# EAGLE design led-er-v2 (EAGLE 7.2.0)
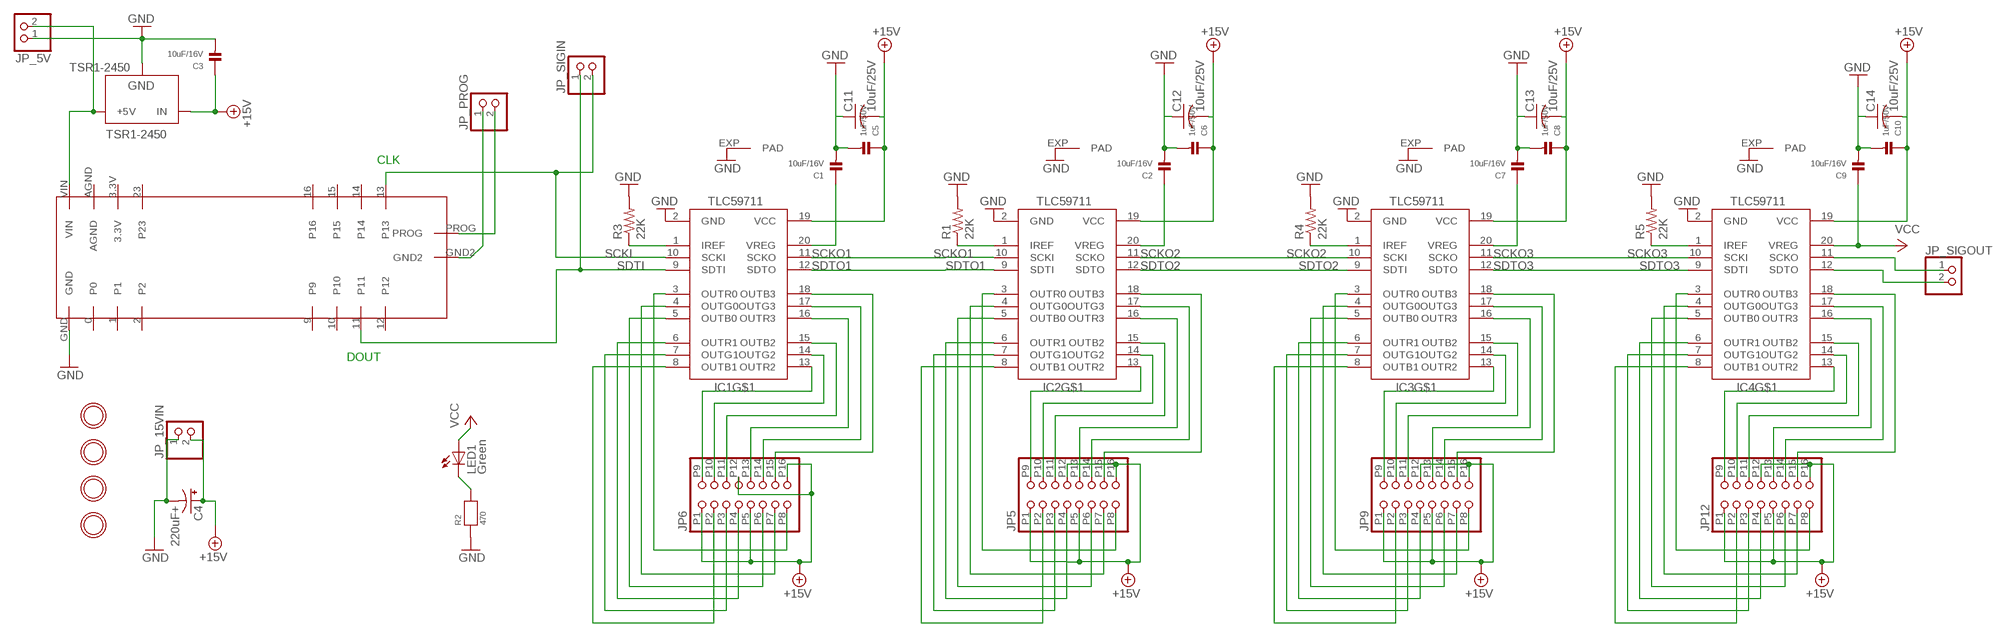
[diagram p0: schematic, sheet 1]

## Parts
C1  10uF/16V  CAP_CERAMIC0805  [0805]
C2  10uF/16V  CAP_CERAMIC0805  [0805]
C3  10uF/16V  CAP_CERAMIC0805  [0805]
C4  220uF+  CPOL-USE5-8.5  [E5-8,5]
C5  1uF/50V  CAP_CERAMIC0805  [0805]
C6  1uF/50V  CAP_CERAMIC0805  [0805]
C7  10uF/16V  CAP_CERAMIC0805  [0805]
C8  1uF/50V  CAP_CERAMIC0805  [0805]
C9  10uF/16V  CAP_CERAMIC0805  [0805]
C10  1uF/50V  CAP_CERAMIC0805  [0805]
C11  10uF/25V  C-USC0805  [C0805]
C12  10uF/25V  C-USC0805  [C0805]
C13  10uF/25V  C-USC0805  [C0805]
C14  10uF/25V  C-USC0805  [C0805]
IC1  TLC59711  [HTSSOP20DAP]
IC2  TLC59711  [HTSSOP20DAP]
IC3  TLC59711  [HTSSOP20DAP]
IC4  TLC59711  [HTSSOP20DAP]
JP5  HEADER-2X8  [2X08]
JP6  HEADER-2X8  [2X08]
JP9  HEADER-2X8  [2X08]
JP12  HEADER-2X8  [2X08]
JP_5V  HEADER-1X2  [1X02_OVAL]
JP_15VIN  HEADER-1X2  [1X02_OVAL]
JP_PROG  HEADER-1X2  [1X02_OVAL]
JP_SIGIN  HEADER-1X2  [1X02_OVAL]
JP_SIGOUT  HEADER-1X2  [1X02_OVAL]
LED1  Green  LEDCHIP-LED0805  [CHIP-LED0805]
R1  22K  R-US_FLIPFLOP7  [0805-THM-7]
R2  470  RESISTOR0805  [0805]
R3  22K  R-US_FLIPFLOP7  [0805-THM-7]
R4  22K  R-US_FLIPFLOP7  [0805-THM-7]
R5  22K  R-US_FLIPFLOP7  [0805-THM-7]
TSR1-2450  TSR1-2450  [TSR-1]
U$1  MOUNTINGHOLE  [MOUNTINGHOLE_3.0_PLATED]
U$2  MOUNTINGHOLE  [MOUNTINGHOLE_3.0_PLATED]
U$3  MOUNTINGHOLE  [MOUNTINGHOLE_3.0_PLATED]
U$4  MOUNTINGHOLE  [MOUNTINGHOLE_3.0_PLATED]
U$5  TEENSY_LEDER  [TEENSY_LEDER]

## Nets
+15V: C3.1 C4.+ C5.1 C6.1 C8.1 C10.1 C11.2 C12.2 C13.2 C14.2 IC1.19(VCC) IC2.19(VCC) IC3.19(VCC) IC4.19(VCC) JP5.P1 JP5.P5 JP5.P12 JP5.P16 JP6.P1 JP6.P5 JP6.P12 JP6.P16 JP9.P1 JP9.P5 JP9.P12 JP9.P16 JP12.P1 JP12.P5 JP12.P12 JP12.P16 JP_15VIN.2 TSR1-2450.1(IN)
GND: C1.2 C2.2 C3.2 C4.- C5.2 C6.2 C7.2 C8.2 C9.2 C10.2 C11.1 C12.1 C13.1 C14.1 IC1.2(GND) IC1.EXP(PAD) IC2.2(GND) IC2.EXP(PAD) IC3.2(GND) IC3.EXP(PAD) IC4.2(GND) IC4.EXP(PAD) JP_5V.1 JP_15VIN.1 R1.2 R2.1 R3.2 R4.2 R5.2 TSR1-2450.2(GND) U$5.GND
JP1: JP_5V.2 TSR1-2450.3(+5V) U$5.VIN
N$1: LED1.C R2.2
N$2: IC1.1(IREF) R3.1
N$3: IC1.3(OUTR0) JP6.P8
N$4: IC1.4(OUTG0) JP6.P7
N$5: IC1.5(OUTB0) JP6.P6
N$6: IC1.6(OUTR1) JP6.P4
N$7: IC1.7(OUTG1) JP6.P3
N$8: IC1.8(OUTB1) JP6.P2
N$9: IC1.13(OUTR2) JP6.P9
N$10: IC1.14(OUTG2) JP6.P10
N$11: IC1.15(OUTB2) JP6.P11
N$12: IC1.16(OUTR3) JP6.P13
N$13: IC1.17(OUTG3) JP6.P14
N$14: IC1.18(OUTB3) JP6.P15
N$15: IC2.1(IREF) R1.1
N$16: IC2.3(OUTR0) JP5.P8
N$17: IC2.4(OUTG0) JP5.P7
N$18: IC2.5(OUTB0) JP5.P6
N$19: IC2.6(OUTR1) JP5.P4
N$20: IC2.7(OUTG1) JP5.P3
N$21: IC2.8(OUTB1) JP5.P2
N$22: IC2.13(OUTR2) JP5.P9
N$23: IC2.14(OUTG2) JP5.P10
N$24: IC2.15(OUTB2) JP5.P11
N$25: IC2.16(OUTR3) JP5.P13
N$26: IC2.17(OUTG3) JP5.P14
N$27: IC2.18(OUTB3) JP5.P15
N$28: IC3.1(IREF) R4.1
N$29: IC3.3(OUTR0) JP9.P8
N$30: IC3.4(OUTG0) JP9.P7
N$31: IC3.5(OUTB0) JP9.P6
N$32: IC3.6(OUTR1) JP9.P4
N$33: IC3.7(OUTG1) JP9.P3
N$34: IC3.8(OUTB1) JP9.P2
N$35: IC3.13(OUTR2) JP9.P9
N$36: IC3.14(OUTG2) JP9.P10
N$37: IC3.15(OUTB2) JP9.P11
N$38: IC3.16(OUTR3) JP9.P13
N$39: IC3.17(OUTG3) JP9.P14
N$40: IC3.18(OUTB3) JP9.P15
N$41: IC4.1(IREF) R5.1
N$42: IC4.3(OUTR0) JP12.P8
N$43: IC4.4(OUTG0) JP12.P7
N$44: IC4.5(OUTB0) JP12.P6
N$45: IC4.6(OUTR1) JP12.P4
N$46: IC4.7(OUTG1) JP12.P3
N$47: IC4.8(OUTB1) JP12.P2
N$48: IC4.13(OUTR2) JP12.P9
N$49: IC4.14(OUTG2) JP12.P10
N$50: IC4.15(OUTB2) JP12.P11
N$51: IC4.16(OUTR3) JP12.P13
N$52: IC4.17(OUTG3) JP12.P14
N$53: IC4.18(OUTB3) JP12.P15
N$54: JP_PROG.1 U$5.GND2
N$55: JP_PROG.2 U$5.PROG
N$56: C1.1 IC1.20(VREG)
N$57: C7.1 IC3.20(VREG)
N$58: C2.1 IC2.20(VREG)
N$59: IC4.11(SCKO) JP_SIGOUT.1
N$60: IC4.12(SDTO) JP_SIGOUT.2
SCKI: IC1.10(SCKI) JP_SIGIN.2 U$5.13
SCKO1: IC1.11(SCKO) IC2.10(SCKI)
SCKO2: IC2.11(SCKO) IC3.10(SCKI)
SCKO3: IC3.11(SCKO) IC4.10(SCKI)
SDTI: IC1.9(SDTI) JP_SIGIN.1 U$5.11
SDTO1: IC1.12(SDTO) IC2.9(SDTI)
SDTO2: IC2.12(SDTO) IC3.9(SDTI)
SDTO3: IC3.12(SDTO) IC4.9(SDTI)
VCC: C9.1 IC4.20(VREG) LED1.A
Unconnected: U$5.0 U$5.1 U$5.2 U$5.3.3V U$5.9 U$5.10 U$5.12 U$5.14 U$5.15 U$5.16 U$5.23 U$5.AGND

## Notes on the sheet
- CLK
- DOUT

## Library data of the parts
C1-C3 C5-C10 = microbuilder:CAP_CERAMIC: Ceramic Capacitors 0402 - 0402 Surface Mount Capacitors 16pF 50V 5% [Digikey: 445-4899-2-ND] 18pF 50V 5% [Digikey: 490-1281-2-ND] 22pF 50V 5% [Digikey: 490-1283-2-ND] 68pF 50V 5% [Digikey: 490-1289-2-ND] 0.1uF 10V 10% [Digikey: 490-1318-2-ND] 1.0uF 6.3V 10% [Digikey: 490-1320-2-ND] 0603 - 0603 Surface Mount Capacitors 16 pF 50V 5% [Digikey: 445-5051-2-ND] 22 pF 50V [Digikey: PCC220ACVTR-ND] 33 pF 50V 5% [Digikey: 490-1415-1-ND] 56pF 50V 5% [Digikey: 490-1421-1-ND] 220pF 50V 5% [Digikey: 445-1285-1-ND] 680 pF 50V 2200 pF 50V 5% C0G [Digikey: 445-1297-1-ND] 5600 pF 100V 5% X7R [Digikey: 478-3711-1-ND] 0.1 µF 25V 10% [Digikey: PCC2277TR-ND] 0.22 µF 16V 10% X7R [Digikey: 445-1318-1-ND] 1.0 µF 25V 10% [Digikey: 445-5146-2-ND] 0603 - RF Specific 3pF 250V +/-0.1pF RF [Digikey: 712-1347-1-ND] 18 pF 250V 5% [Digikey: 478-3505-1-ND or 712-1322-1-ND] 56 pF 250V 5% C0G RF [Digikey: 490-4867-1-ND] 68 pF 250V RF [Digikey: 490-4868-1-ND] 0805 - 0805 Surface Mount Capacitors 220 pF 250V 2% RF Ceramic Capacitor [Digikey: 712-1398-1-ND] 1000 pF 50V 2% NP0 Ceramic Capacitor [Digikey: 478-3760-1-ND] 0.1 µF 25V 10% Ceramic Capacitor [Digikey: PCC1828TR-ND] 1.0 µF 16V 10% Ceramic Capacitor[Digikey: 490-1691-2-ND] 10.0 µF 10V 10% Ceramic Capacitor[Digikey: 709-1228-1-ND] 10.0 uF 16V 10% Ceramic Capacitor [Digikey: 478-5165-2-ND] 47 uF 6.3V 20% Ceramic Capacitor [Digikey: 587-1779-1-ND or 399-5506-1-ND] 1206 - 1206 Surface Mount Capacitors 47uF 10V 20% Ceramic Capacitor [Digikey: 490-5528-1-ND or 399-5508-1-ND or 445-6010-1-ND] 100uF 6.3V -20%, +80% Y5V Ceramic Capacitor (Digikey: 490-4512-1-ND, Mouser: 81-GRM31CF50J107ZE1L)
C4 = adafruit:CPOL-US: POLARIZED CAPACITOR, American symbol
C11-C14 = adafruit:C-US: CAPACITOR, American symbol
IC1-IC4 = adafruit:TLC59711
JP5 JP6 JP9 JP12 = Andrews:HEADER-2X8: 2x8 shrouded header
JP_5V JP_15VIN JP_PROG JP_SIGIN JP_SIGOUT = microbuilder:HEADER-1X2: PIN HEADER
LED1 = adafruit:LED: LED OSRAM: - CHIPLED LG R971, LG N971, LY N971, LG Q971, LY Q971, LO R971, LY R971 LH N974, LH R974 LS Q976, LO Q976, LY Q976 LO Q996 - Hyper CHIPLED LW Q18S LB Q993, LB Q99A, LB R99A - SideLED LS A670, LO A670, LY A670, LG A670, LP A670 LB A673, LV A673, LT A673, LW A673 LH A674 LY A675 LS A676, LA A676, LO A676, LY A676, LW A676 LS A679, LY A679, LG A679 - Hyper Micro SIDELED® LS Y876, LA Y876, LO Y876, LY Y876 LT Y87S - SmartLED LW L88C, LW L88S LB L89C, LB L89S, LG L890 LS L89K, LO L89K, LY L89K LS L896, LA L896, LO L896, LY L896 - TOPLED LS T670, LO T670, LY T670, LG T670, LP T670 LSG T670, LSP T670, LSY T670, LOP T670, LYG T670 LG T671, LOG T671, LSG T671 LB T673, LV T673, LT T673, LW T673 LH T674 LS T676, LA T676, LO T676, LY T676, LB T676, LH T676, LSB T676, LW T676 LB T67C, LV T67C, LT T67C, LS T67K, LO T67K, LY T67K, LW E67C LS E67B, LA E67B, LO E67B, LY E67B, LB E67C, LV E67C, LT E67C LW T67C LS T679, LY T679, LG T679 LS T770, LO T770, LY T770, LG T770, LP T770 LB T773, LV T773, LT T773, LW T773 LH T774 LS E675, LA E675, LY E675, LS T675 LS T776, LA T776, LO T776, LY T776, LB T776 LHGB T686 LT T68C, LB T68C - Hyper Mini TOPLED® LB M676 - Mini TOPLED Santana® LG M470 LS M47K, LO M47K, LY M47K Source: http://www.osram.convergy.de/
R1 R3-R5 = adafruit:R-US_: RESISTOR, American symbol
R2 = microbuilder:RESISTOR: Resistors 0402 - 0402 Surface Mount Package 22 Ohm 1% 1/16W [Digikey: 311-22.0LRTR-ND] 33 Ohm 5% 1/16W 1.0K 5% 1/16W 1.5K 5% 1/16W 2.0K 1% 1/16W 10.0K 1% 1/16W [Digikey: 311-10.0KLRTR-ND] 10.0K 5% 1/16W [Digikey: RMCF0402JT10K0TR-ND] 12.1K 1% 1/16W [Digikey: 311-22.0LRTR-ND] 100.0K 5% 1/16W 0603 - 0603 Surface Mount Package 0 Ohm 1/10 Watt 1% Resistor 15 Ohm 1/10 Watt 1% Resistor 33 Ohm 1/10 Watt 1% Resistor 49.9 Ohm 1/10 Watt 1% Resistor 100 Ohm 1/10 Watt 1% Resistor 150 Ohm 1/10 Watt 1% Resistor 240 Ohm 1/10 Watt 1% Resistor 390 Ohm 1/10 Watt 1% Resistor 560 Ohm 1/10 Watt 1% Resistor 680 Ohm 1/10 Watt 1% Resistor 750 Ohm 1/10 Watt 1% Resistor 1.0K Ohm 1/10 Watt 1% Resistor 1.5K Ohm 1/10 Watt 1% Resistor 2.0K Ohm 1/10 Watt 1% Resistor 2.2K Ohm 1/10 Watt 1% Resistor 3.3K Ohm 1/10 Watt 1% Resistor 4.7K Ohm 1/10 Watt 1% Resistor 10.0K Ohm 1/10 Watt 1% Resistor 12.0K Ohm 1/10 Watt 1% Resistor 12.1K Ohm 1/10 Watt 1% Resistor 20.0K Ohm 1/10 Watt 1% Resistor 33.0K Ohm 1/10 Watt 1% Resistor 100.0K Ohm 1/10 Watt 1% Resistor 0805 - 0805 Surface Mount Package 0 Ohm 1/8 Watt 1% Resistor 33 Ohm 1/8 Watt 1% Resistor 100 Ohm 1/8 Watt 1% Resistor 150 Ohm 1/8 Watt 1% Resistor 200 Ohm 1/8 Watt 1% Resistor 240 Ohm 1/8 Watt 1% Resistor 330 Ohm 1/8 Watt 1% Resistor 390 Ohm 1/8 Watt 1% Resistor 470 Ohm 1/8 Watt 1% Resistor 1.0K Ohm 1/8 Watt 1% Resistor 1.5K Ohm 1/8 Watt 1% Resistor 2.0K Ohm 1/8 Watt 1% Resistor 4.7K Ohm 1/8 Watt 1% Resistor 5.1K Ohm 1/8 Watt 1% Resistor 5.6K Ohm 1/8 Watt 1% Resistor 10.0K Ohm 1/8 Watt 1% Resistor 22.0K Ohm 1/8 Watt 1% Resistor 33.0K Ohm 1/8 Watt 1% Resistor 100K Ohm 1/8 Watt 1% Resistor 1206 - 1206 Surface Mount Package 2012 - 2010 Surface Mount Package 0.11 Ohm 1/2 Watt 1% Resistor - Digikey: RHM.11UCT-ND
TSR1-2450 = SteelCaveRobotics-Power:TSR1-2450: Traco Power TSR 1-2450 5.0v switching regulator
U$1-U$4 = microbuilder:MOUNTINGHOLE: Mounting Hole For #2 screws (0.086"/2.18mm width, 0.094"/2.4mm hole) use 2.5mm
U$5 = Andrews:TEENSY_LEDER

## Board
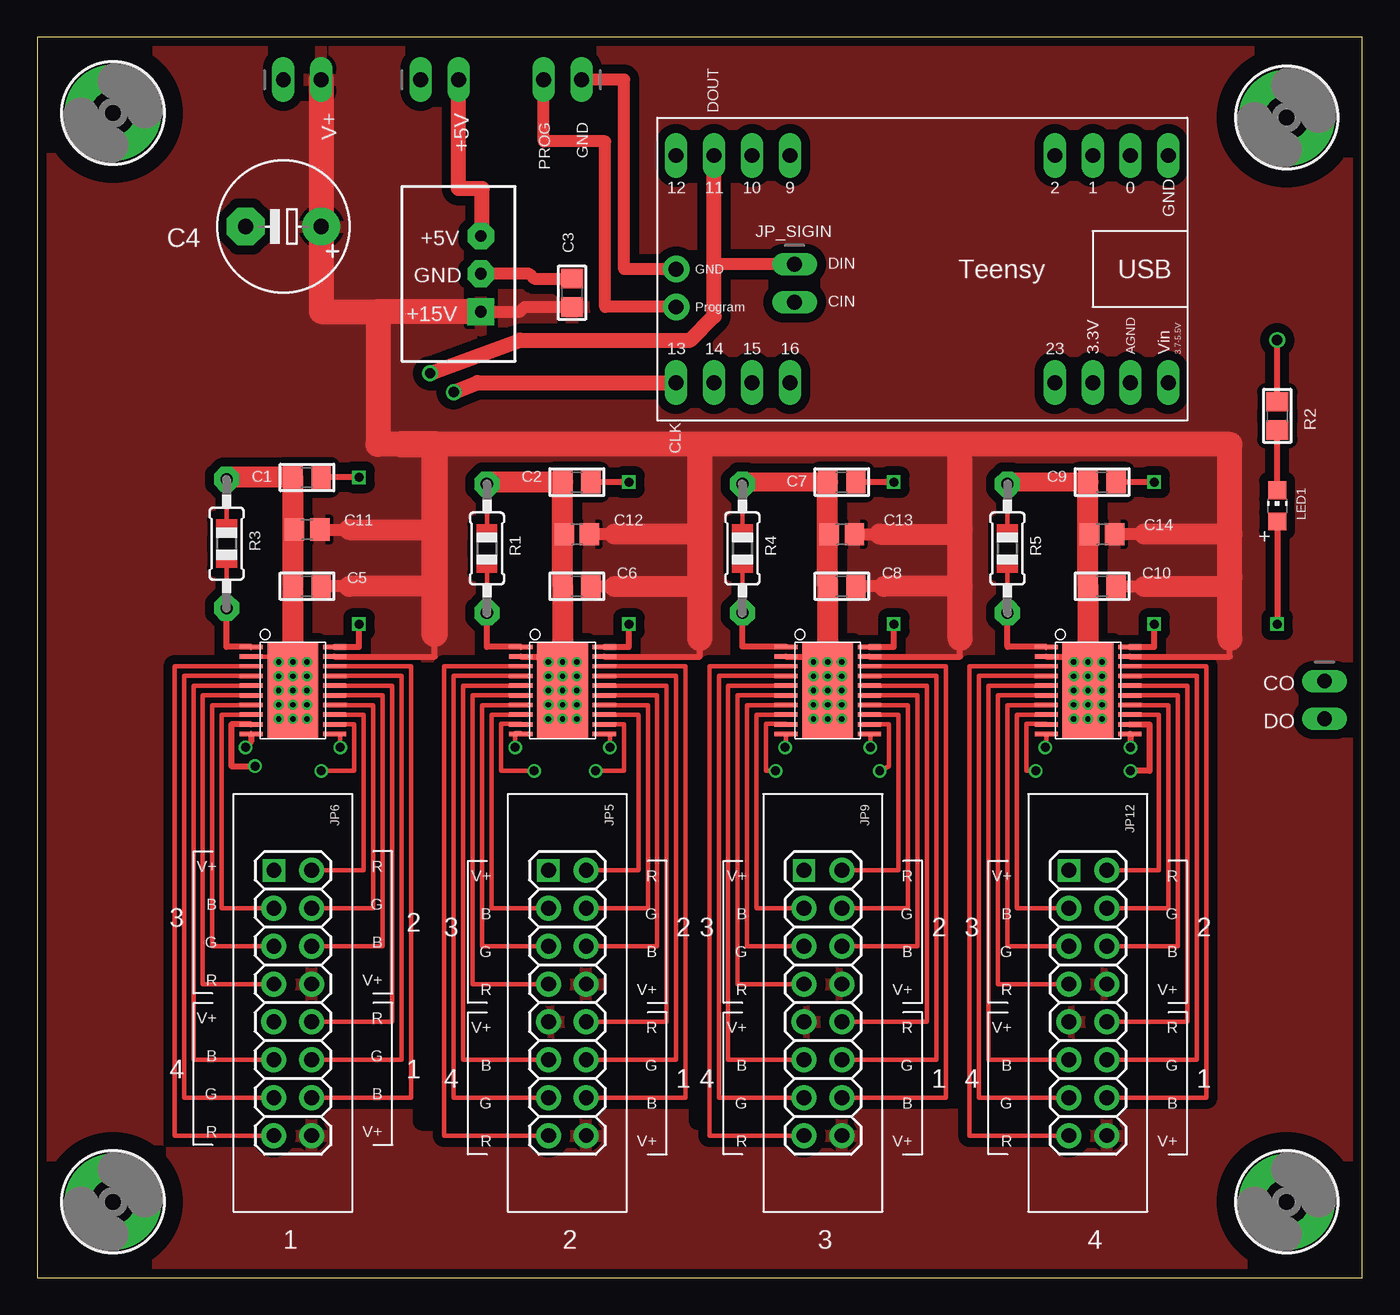
[diagram p1: board, top side]
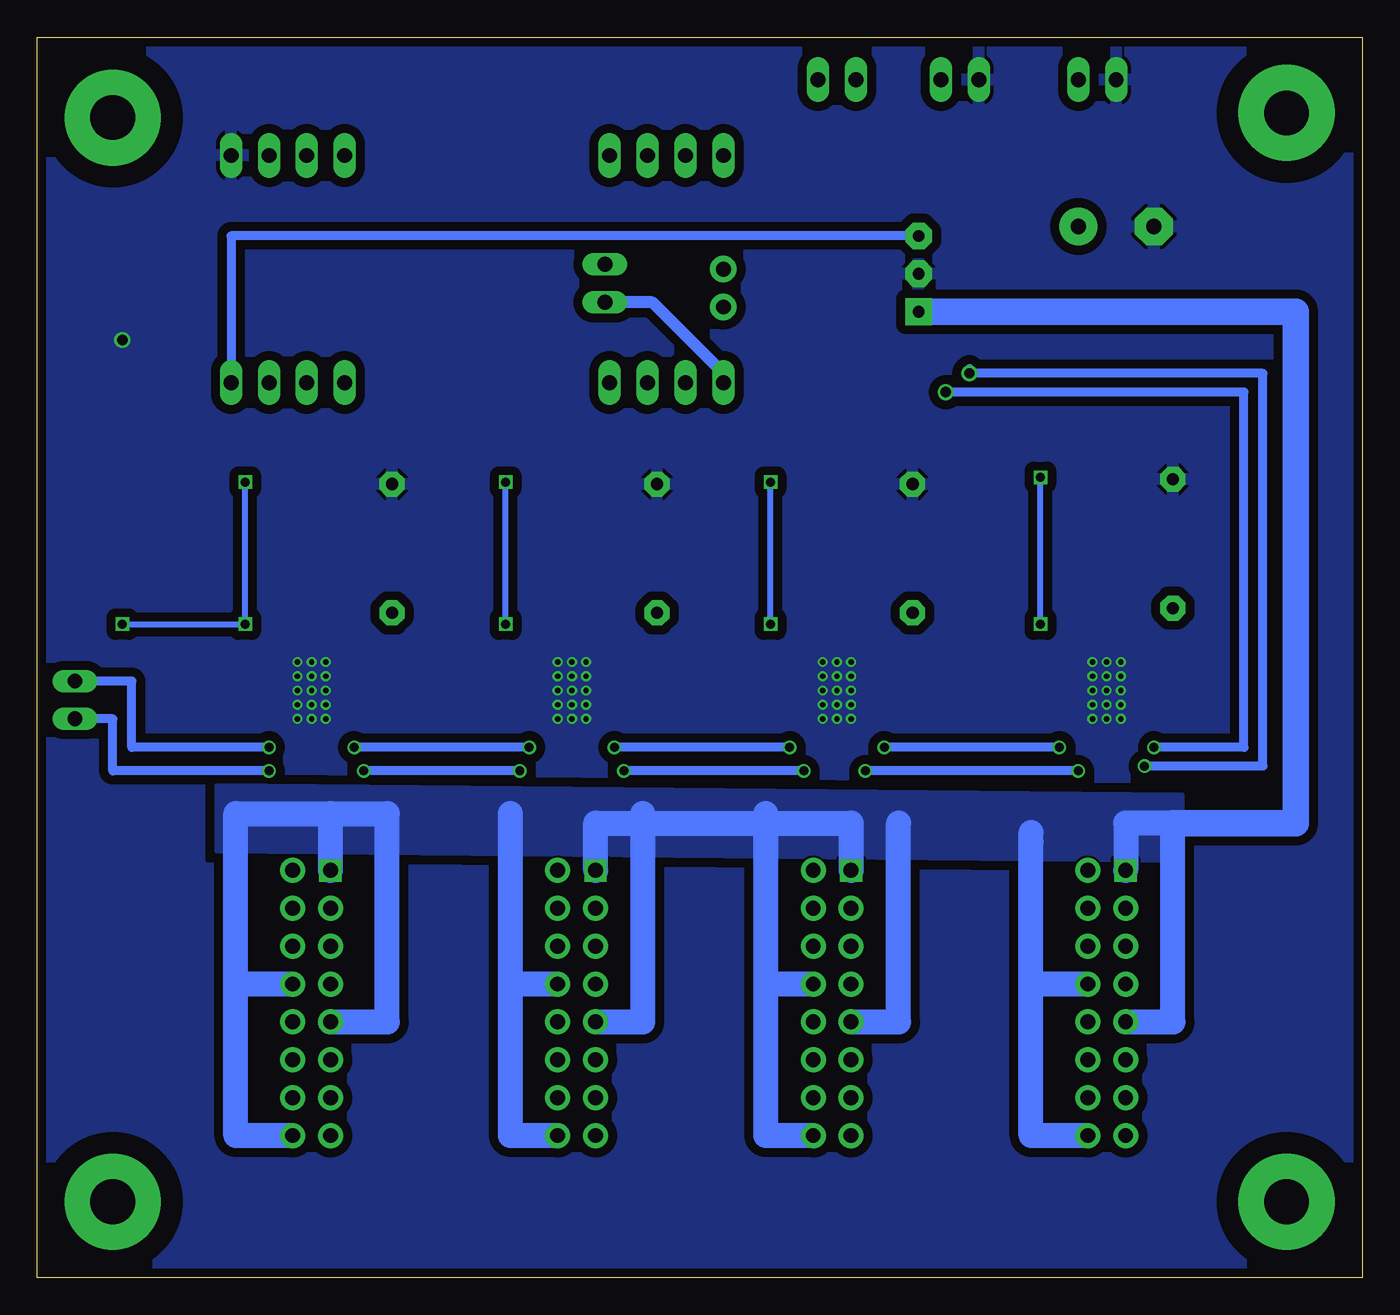
[diagram p2: board, bottom side, seen from below]

Size 88.89 x 83.17 mm. Coordinates in mm from the lower left corner, seen from the top.
Outline: 0,0 88.89,0 88.89,83.17 0,83.17 0,0
Copper layers (1*16): Top 0.035mm / dielectric 1.5mm / Bottom 0.035mm
Design rules "SeeedStudio_2layer_DRU_no_angle_20140221 *": minimum track width 6mil, minimum drill 12mil, track to track 6mil, track to pad 6mil, pad to pad 6mil, via to via 6mil, smd to smd 0mil, copper to edge 10mil, drill to drill 10mil, minimum pad ring 10mil, minimum via ring 6mil, stop-mask expansion 2mil, vias tented up to drill 100mil, thermal gap 10mil
tRestrict: area 10.8,14 to 16.5,17.8; area 19.7,16.5 to 23.5,20.3; area 28.6,14 to 33.7,17.8; area 38.7,16.5 to 41.9,20.3; area 25.8,10.4 to 26.5,12.7; area 44.3,10.5 to 45.5,12.6; area 63,10.6 to 63.9,12.8; area 15.2,36.6 to 15.8,37.7; area 47,15.2 to 50.8,19.1; area 54.6,17.8 to 59.1,21.6; area 64.1,15.2 to 68.6,19.1; area 72.4,17.8 to 76.2,21.6; 5 more areas

### Footprints (pad centres in the part's own frame; a part is rotated, then mirrored left to right if it is on the bottom)
0805 = smd 1.3 x 1.5: 1 -0.95,0; 2 0.95,0
E5-8,5 = drill 1.016 pad 2.54: + -2.54,0 | drill 1.016 pad 2.54 octagon: - 2.54,0
C0805 = smd 1.3 x 1.5: 1 -0.85,0; 2 0.85,0
HTSSOP20DAP = smd 0.3 x 1.55: 1 -2.925,-2.8; 2 -2.275,-2.8; 3 -1.625,-2.8; 4 -0.975,-2.8; 5 -0.325,-2.8; 6 0.325,-2.8; 7 0.975,-2.8; 8 1.625,-2.8; 9 2.275,-2.8; 10 2.925,-2.8; 11 2.925,2.8; 12 2.275,2.8; 13 1.625,2.8; 14 0.975,2.8; 15 0.325,2.8; 16 -0.325,2.8; 17 -0.975,2.8; 18 -1.625,2.8; 19 -2.275,2.8; 20 -2.925,2.8 | smd 6.5 x 3.4: EXP 0,0
2X08 = drill 1 square: P1 -8.89,-1.27 | drill 1 pad 1.676: P2 -6.35,-1.27; P3 -3.81,-1.27; P4 -1.27,-1.27; P5 1.27,-1.27; P6 3.81,-1.27; P7 6.35,-1.27; P8 8.89,-1.27; P9 -8.89,1.27; P10 -6.35,1.27; P11 -3.81,1.27; P12 -1.27,1.27; P13 1.27,1.27; P14 3.81,1.27; P15 6.35,1.27; P16 8.89,1.27
1X02_OVAL = drill 1 long: 1 -1.27,0; 2 1.27,0
CHIP-LED0805 = smd 1.2 x 1.2: A 0,-1.05; C 0,1.05
0805-THM-7 = drill 0.813 pad 1.676 octagon: 1 -4.318,0; 2 4.318,0
TSR-1 = drill 0.8 pad 1.8 square: 1 -2.54,-1.5 | drill 0.8 pad 1.8 octagon: 2 0,-1.5; 3 2.54,-1.5
MOUNTINGHOLE_3.0_PLATED = drill 3 pad 6.452: P$1 0,0
TEENSY_LEDER = drill 1 pad 1.422 long: 0 12.7,7.62; 1 10.16,7.62; 2 7.62,7.62; 3.3V 10.16,-7.62; 9 -10.16,7.62; 10 -12.7,7.62; 11 -15.24,7.62; 12 -17.78,7.62; 13 -17.78,-7.62; 14 -15.24,-7.62; 15 -12.7,-7.62; 16 -10.16,-7.62; 23 7.62,-7.62; AGND 12.7,-7.62; GND 15.24,7.62; VIN 15.24,-7.62 | drill 1 pad 1.778: GND2 -17.78,0; PROG -17.78,-2.54

### Placement (x,y rotation side)
C1  18.1,53.66 180 top
C2  36.2,53.34 180 top
C3  35.88,66.04 90 top
C4  16.51,70.48 180 top
C5  18.1,46.35 180 top
C6  36.2,46.35 180 top
C7  53.98,53.34 180 top
C8  53.98,46.35 180 top
C9  71.44,53.34 180 top
C10  71.44,46.35 180 top
C11  18.1,50.16 0 top
C12  36.2,49.85 0 top
C13  53.98,49.85 0 top
C14  71.44,49.85 0 top
IC1  17.14,39.37 270 top
IC2  35.24,39.37 270 top
IC3  53.02,39.37 270 top
IC4  70.48,39.37 270 top
JP5  35.56,18.41 270 top
JP6  17.14,18.41 270 top
JP9  52.7,18.41 270 top
JP12  70.48,18.41 270 top
JP_5V  26.99,80.33 0 top
JP_15VIN  17.78,80.33 0 top
JP_PROG  35.24,80.33 180 top
JP_SIGIN  50.8,66.67 270 top
JP_SIGOUT  86.36,38.73 270 top
LED1  83.19,51.75 0 top
R1  30.16,48.9 90 top
R2  83.19,57.78 270 top
R3  12.7,49.21 90 top
R4  47.31,48.9 90 top
R5  65.09,48.9 90 top
TSR1-2450  28.26,67.31 90 top
U$1  83.82,77.79 0 top
U$2  5.08,5.08 0 top
U$3  83.82,5.08 0 top
U$4  5.08,78.11 0 top
U$5  60.64,67.63 0 top

### Tracks (layer width: path | path; a pad name or v marks a point on that pad's centre or on a via)
+15V
  Top 0.406: IC1.19 26.67,41.65 26.67,43.18 | IC2.19 44.45,41.65 44.45,42.86 | IC3.19 61.91,41.65 61.91,42.86 | IC4.19 80.01,41.65 80.01,42.86
  Top 0.813: 22.86,64.77 32.38,64.77 32.7,65.09 35.24,65.09 C3.1 | C11.2 20.95,50.16 | 38.73,49.85 C12.2 | C13.2 56.52,49.85 | 74.3,49.85 C14.2 | C6.1 38.73,46.35 | 56.83,46.35 C8.1 | C10.1 74.3,46.35 | 20.95,46.35 C5.1
  Top 1.422: 44.45,49.85 38.73,49.85 | 56.52,49.85 61.91,49.85 61.91,50.16 | 80.01,49.85 74.3,49.85 | 38.73,46.35 44.45,46.35 | 61.91,46.35 56.83,46.35 | 74.3,46.35 80.01,46.35 80.01,46.99 | 26.67,46.35 20.95,46.35 | 20.95,50.16 26.67,50.16 26.67,49.85
  Top 1.676: 44.45,55.88 24.45,55.88 22.86,55.88 22.86,64.77 | 61.91,55.88 80.01,55.88 80.01,49.85 80.01,46.99 80.01,42.86 | 61.91,55.88 44.45,55.88 | JP_15VIN.2 C4.+ 19.05,64.77 22.86,64.77 | TSR1-2450.1 22.86,64.77 | 44.45,55.88 44.45,49.85 44.45,46.35 44.45,42.86 | 61.91,42.86 61.91,46.35 61.91,50.16 61.91,55.88
  Top 1.778: 24.45,55.88 26.67,55.88 26.67,49.85 26.67,46.35 26.67,43.18
  Bottom 1.676: JP6.P1 15.88,30.48 12.7,30.48 12.7,17.14 JP6.P5 | JP6.P12 22.23,19.68 22.23,29.21 | JP6.P16 22.23,9.53 22.23,29.84 | JP5.P12 40.01,19.68 | 40.01,19.68 40.01,31.11 | JP5.P16 40.01,9.53 40.01,19.68 | JP5.P5 31.11,17.14 31.11,30.48 | JP9.P12 57.15,19.68 | 57.15,19.68 57.15,31.11 | JP9.P16 57.15,9.53 57.15,19.68 | JP9.P5 48.26,17.14 48.26,31.11 | JP12.P12 75.56,19.68 | 75.56,19.68 75.56,31.11 69.22,31.11 | 69.22,31.11 65.41,31.11 65.41,17.14 JP12.P5 | JP12.P16 75.56,9.53 75.56,19.68 | JP12.P1 69.22,31.11 | JP9.P1 51.44,30.48 34.29,30.48 JP5.P1
  Bottom 1.778: 12.7,30.48 4.45,30.48 4.45,64.77 TSR1-2450.1
  pour Bottom: 12.06,32.38 12.06,27.94 76.83,28.57 76.83,33.02
  pour Top (isolate 0.61, rank 2): 0,83.19 0,0 88.9,0 88.9,83.19
GND  (via drill 0.36, 0.7)
  Top 0.305: 33.92,41.65 v34.29,41.27 | IC1.2 16.19,41.65 v16.19,41.27
  Top 0.406: IC2.2 33.92,41.65 | R2.1 v83.19,62.87 | IC3.2 52.07,41.65 v52.07,41.27 | IC4.2 69.53,41.65 v69.53,41.27
  Top 0.813: C3.2 35.24,66.99 33.34,66.99 33.02,67.31 TSR1-2450.2 | C2.2 35.34,53.34 C12.1 | 30.16,53.34 R1.2 | C1.2 17.25,53.66 C11.1
  Top 1.016: C12.1 35.24,49.85 | C13.1 53.02,49.85 C8.2 | C14.1 70.49,49.85 70.49,52.7
  Top 1.27: 12.7,53.66 R3.2 | C11.1 17.15,50.16 | C7.2 47.31,53.34 R4.2 | C9.2 65.09,53.34 R5.2
  Top 1.422: 17.14,46.04 v17.14,41.27 | C6.2 | C6.2 v35.24,41.27 | 53.02,46.67 v53.02,41.27 | C8.2 C7.2 | v70.48,41.27 C10.2 70.49,52.7 C9.2 | 30.16,53.34 C2.2 C6.2 | 12.7,53.66 C1.2 C5.2
  other vias: 70.48,39.37 71.44,37.47 70.48,37.47 69.53,37.47 71.44,38.42 70.48,38.42 69.53,38.42 71.44,39.37 69.53,39.37 71.44,40.32 70.48,40.32 69.53,40.32 53.02,39.37 53.98,39.37 52.07,39.37 53.98,38.42 53.02,38.42 52.07,38.42 53.98,37.47 53.02,37.47 52.07,37.47 53.98,40.32 53.02,40.32 52.07,40.32 35.24,39.37 36.2,39.37 34.29,39.37 34.29,38.42 35.24,38.42 36.2,38.42 36.2,40.32 35.24,40.32 34.29,40.32 34.29,37.47 35.24,37.47 36.2,37.47 17.14,39.37 16.19,39.37 18.1,39.37 18.1,40.32 17.14,40.32 16.19,40.32 18.1,41.27 18.1,38.42 17.14,38.42 16.19,38.42 16.19,37.47 17.14,37.47 18.1,37.47 36.2,41.27 53.98,41.27 71.44,41.27
  pour Bottom (isolate 0.61, rank 2): 0,83.19 0,0 88.9,0 88.9,83.19
JP1
  Top 0.61: TSR1-2450.3 29.84,69.85
  Top 1.016: 29.84,69.85 29.84,73.03 28.26,73.03 JP_5V.2
  Bottom 0.61: TSR1-2450.3 75.88,69.85 U$5.VIN
N$1
  Top 0.406: LED1.C R2.2
N$2
  Top 0.406: IC1.1 12.7,42.3 R3.1
N$3
  Top 0.305: IC1.3 9.21,40.99 9.21,9.53 JP6.P8
N$4
  Top 0.305: IC1.4 9.84,40.34 9.84,12.06 JP6.P7
N$5
  Top 0.305: IC1.5 10.48,39.7 10.48,14.61 JP6.P6
N$6
  Top 0.305: IC1.6 11.11,39.05 11.11,19.68 JP6.P4
N$7
  Top 0.305: IC1.7 11.75,38.4 11.75,22.23 JP6.P3
N$8
  Top 0.305: IC1.8 12.38,37.74 12.38,24.77 JP6.P2
N$9
  Top 0.305: IC1.13 21.91,37.74 21.91,27.3 JP6.P9
N$10
  Top 0.305: IC1.14 22.54,38.4 22.54,24.77 JP6.P10
N$11
  Top 0.305: IC1.15 23.18,39.05 23.18,22.23 JP6.P11
N$12
  Top 0.305: IC1.16 23.81,39.7 23.81,17.14 JP6.P13
N$13
  Top 0.305: IC1.17 24.45,40.34 24.45,14.61 JP6.P14
N$14
  Top 0.305: IC1.18 25.08,40.99 25.08,12.06 JP6.P15
N$15
  Top 0.406: IC2.1 30.16,42.3 R1.1
N$16
  Top 0.305: IC2.3 27.3,40.99 27.3,9.53 JP5.P8
N$17
  Top 0.305: IC2.4 27.94,40.34 27.94,12.06 JP5.P7
N$18
  Top 0.305: IC2.5 28.57,39.7 28.57,14.61 JP5.P6
N$19
  Top 0.305: IC2.6 29.21,39.05 29.21,19.68 JP5.P4
N$20
  Top 0.305: IC2.7 29.84,38.4 29.84,22.23 JP5.P3
N$21
  Top 0.305: IC2.8 30.48,37.74 30.48,24.77 JP5.P2
N$22
  Top 0.305: IC2.13 40.32,37.74 40.32,27.3 JP5.P9
N$23
  Top 0.305: IC2.14 40.96,38.4 40.96,24.77 JP5.P10
N$24
  Top 0.305: IC2.15 41.59,39.05 41.59,22.23 JP5.P11
N$25
  Top 0.305: IC2.16 42.23,39.7 42.23,17.14 JP5.P13
N$26
  Top 0.305: IC2.17 42.86,40.34 42.86,14.61 JP5.P14
N$27
  Top 0.305: IC2.18 43.5,40.99 43.5,12.06 JP5.P15
N$28
  Top 0.305: IC3.1 50.2,42.31
  Top 0.406: 50.2,42.31 47.31,42.31 R4.1
N$29
  Top 0.305: IC3.3 45.09,40.99 45.09,9.53 JP9.P8
N$30
  Top 0.305: IC3.4 45.72,40.34 45.72,12.06 JP9.P7
N$31
  Top 0.305: IC3.5 46.35,39.7 46.35,14.61 JP9.P6
N$32
  Top 0.305: IC3.6 46.99,39.05 46.99,19.68 JP9.P4
N$33
  Top 0.305: IC3.7 47.62,38.4 47.62,22.23 JP9.P3
N$34
  Top 0.305: IC3.8 48.26,37.74 48.26,24.77 JP9.P2
N$35
  Top 0.305: IC3.13 57.78,37.74 57.78,27.3 JP9.P9
N$36
  Top 0.305: IC3.14 58.42,38.4 58.42,24.77 JP9.P10
N$37
  Top 0.305: IC3.15 59.05,39.05 59.05,22.23 JP9.P11
N$38
  Top 0.305: IC3.16 59.69,39.7 59.69,17.14 JP9.P13
N$39
  Top 0.305: IC3.17 60.33,40.34 60.33,14.61 JP9.P14
N$40
  Top 0.305: IC3.18 60.96,40.99 60.96,12.06 JP9.P15
N$41
  Top 0.406: IC4.1 65.09,42.3 R5.1
N$42
  Top 0.305: IC4.3 62.55,40.99 62.55,9.53 JP12.P8
N$43
  Top 0.305: IC4.4 63.18,40.34 63.18,12.06 JP12.P7
N$44
  Top 0.305: IC4.5 63.82,39.7 63.82,14.61 JP12.P6
N$45
  Top 0.305: IC4.6 64.45,39.05 64.45,19.68 JP12.P4
N$46
  Top 0.305: IC4.7 65.09,38.4 65.09,22.23 JP12.P3
N$47
  Top 0.305: IC4.8 65.72,37.74 65.72,24.77 JP12.P2
N$48
  Top 0.305: IC4.13 75.25,37.74 75.25,27.3 JP12.P9
N$49
  Top 0.305: IC4.14 75.88,38.4 75.88,24.77 JP12.P10
N$50
  Top 0.305: IC4.15 76.52,39.05 76.52,22.23 JP12.P11
N$51
  Top 0.305: IC4.16 77.15,39.7 77.15,17.14 JP12.P13
N$52
  Top 0.305: IC4.17 77.79,40.34 77.79,14.61 JP12.P14
N$53
  Top 0.305: IC4.18 78.42,40.99 78.42,12.06 JP12.P15
N$54
  Top 0.813: U$5.GND2 39.37,67.63 39.37,80.33 JP_PROG.1
N$55
  Top 0.813: U$5.PROG 38.1,65.09 38.1,76.2 33.97,76.2 JP_PROG.2
N$56  (via drill 0.6)
  Top 0.406: IC1.20 21.59,42.3 v21.59,43.81 | v21.59,53.66 C1.1
  Bottom 0.406: v21.59,43.81 v21.59,53.66
N$57  (via drill 0.6)
  Top 0.406: 56.52,42.3 IC3.20 57.47,42.3 v57.47,43.81 | v57.47,53.34 C7.1
  Bottom 0.406: v57.47,43.81 v57.47,53.34
N$58  (via drill 0.6)
  Top 0.406: IC2.20 39.69,42.3 v39.69,43.81 | v39.69,53.34 C2.1
  Bottom 0.406: v39.69,43.81 v39.69,53.34
N$59  (via drill 0.6)
  Top 0.406: IC4.11 73.34,36.45 v73.34,35.56
  Bottom 0.61: v73.34,35.56 82.55,35.56 82.55,40.01 JP_SIGOUT.1
N$60  (via drill 0.6)
  Top 0.406: IC4.12 74.61,37.09 74.61,33.97 v73.34,33.97
  Bottom 0.61: v73.34,33.97 83.82,33.97 83.82,37.47 JP_SIGOUT.2
SCKI  (via drill 0.6, 0.7)
  Top 0.406: IC1.10 14.35,35.94 v13.97,35.56
  Top 1.016: v27.94,59.37 29.53,60.01 U$5.13
  Bottom 0.61: v13.97,35.56 7.94,35.56 7.94,59.37 v27.94,59.37
  Bottom 0.813: U$5.13 42.86,60.64 47.62,65.41 JP_SIGIN.2
SCKO1  (via drill 0.6)
  Top 0.305: IC1.11 20.32,36.45 v20.32,35.56 | 32.07,36.45 IC2.10 32.44,36.51 32.07,36.51 v32.07,35.56
  Bottom 0.61: v20.32,35.56 v32.07,35.56
SCKO2  (via drill 0.6)
  Top 0.305: IC2.11 38.42,36.45 v38.42,35.56 | v50.16,35.56 50.22,35.56 IC3.10
  Bottom 0.61: v38.42,35.56 v50.16,35.56
SCKO3  (via drill 0.6)
  Top 0.305: IC3.11 55.88,36.45 v55.88,35.56 | v67.63,35.56 67.69,35.56 IC4.10
  Bottom 0.61: v55.88,35.56 v67.63,35.56
SDTI  (via drill 0.6, 0.7)
  Top 0.406: IC1.9 13.02,37.09 13.02,34.29 v14.61,34.29
  Top 0.813: JP_SIGIN.1 45.4,67.94
  Top 1.016: v26.35,60.64 32.38,62.87 43.81,62.87 45.4,64.45 45.4,67.94 U$5.11
  Bottom 0.61: v14.61,34.29 6.67,34.29 6.67,60.64 v26.35,60.64 26.35,60.96
SDTO1  (via drill 0.6)
  Top 0.305: IC1.12 21.27,37.09 21.27,33.97 v19.05,33.97 | v33.34,33.97 31.11,33.97 31.11,37.15 32.44,37.15 IC2.9
  Bottom 0.61: v19.05,33.97 v33.34,33.97
SDTO2  (via drill 0.6)
  Top 0.305: IC2.12 39.37,37.09 39.37,33.97 v37.47,33.97 | v49.53,33.97 48.9,33.97 48.9,37.15 50.22,37.15 IC3.9
  Bottom 0.61: v37.47,33.97 v49.53,33.97
SDTO3  (via drill 0.6)
  Top 0.305: IC3.12 57.15,37.09 57.15,34.29 v56.52,33.97 | v66.99,33.97 66.36,33.97 66.36,37.15 67.69,37.15 IC4.9
  Bottom 0.61: v56.52,33.97 v66.99,33.97
VCC  (via drill 0.6)
  Top 0.406: IC4.20 74.93,42.3 v74.93,43.81 | v74.93,53.34 C9.1 | LED1.A v83.19,43.81
  Bottom 0.406: v74.93,53.34 v74.93,43.81 v83.19,43.81

### Text on the board
tPlace: V+ | +5V | DOUT | PROG | GND | +5V | DIN | GND | CIN | +15V | CLK | CO | DO | V+ | R | V+ | R | V+ | R | V+ | R | 3 | B | G | B | G | B | G | B | G | 2 | 3 | 2 | 3 | 2 | 3 | 2 | G | B | G | B | G | B | G | B | R | V+ | R | V+ | R | V+ | R | V+ | V+ | R | V+ | R | V+ | R | V+ | R | 4 | B | G | 1 | B | G | B | G | B | G | 4 | 1 | 4 | 1 | 4 | 1 | G | B | G | B | G | B | G | B | R | V+ | R | V+ | R | V+ | R | V+ | 1 | 2 | 3 | 4